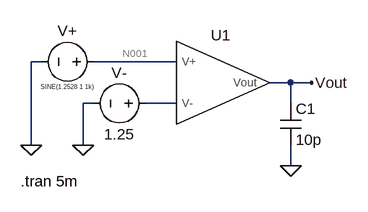
[diagram p0: schematic Draft1.asc]
Draft1.asc, the LTspice schematic file:
Version 4.1
SHEET 1 880 680
WIRE -80 144 -96 144
WIRE 128 144 0 144
WIRE 304 176 272 176
WIRE 336 176 304 176
WIRE 0 208 -16 208
WIRE 128 208 80 208
WIRE 304 208 304 176
WIRE -96 272 -96 144
WIRE -16 272 -16 208
WIRE 304 304 304 272
FLAG -16 272 0
FLAG -96 272 0
FLAG 304 304 0
FLAG 336 176 Vout
SYMBOL Wide_Output_OTA_SYM 192 176 R0
SYMATTR InstName U1
SYMBOL voltage 96 208 R90
WINDOW 0 -32 56 VBottom 2
WINDOW 3 32 56 VTop 2
SYMATTR InstName V-
SYMATTR Value 1.25
SYMBOL voltage 16 144 R90
WINDOW 0 -32 56 VBottom 2
WINDOW 3 32 56 VTop 0
WINDOW 123 0 0 Left 0
WINDOW 39 0 0 Left 0
SYMATTR InstName V+
SYMATTR Value SINE(1.2528 1 1k)
SYMBOL cap 288 208 R0
SYMATTR InstName C1
SYMATTR Value 10p
TEXT -112 328 Left 2 !.tran 5m

The netlist it stands for:
* Draft1.asc
X§U1 N001 N002 Vout Wide_Output_OTA_SYM  ; pins V+ V- Vout
V- N002 0 1.25
V+ N001 0 SINE(1.2528 1 1k)
C1 Vout 0 10p
.tran 5m
.backanno
.end

* Results of the author's LTspice run, read from the files saved beside the schematic
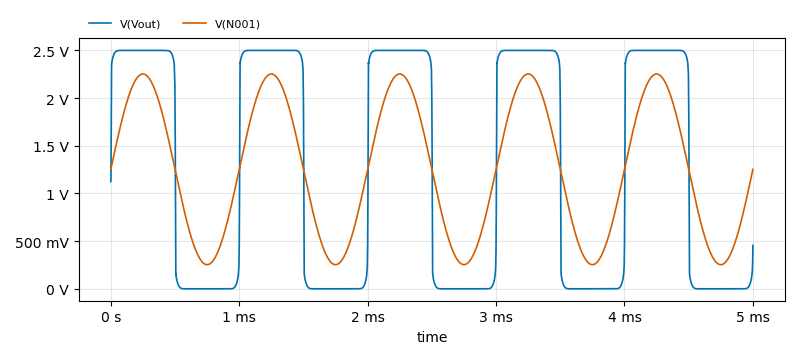
[diagram p1: Transient Analysis of Draft1.asc, plotted from the saved traces]
* Transient Analysis, 1 run:
*   V(Vout): min -24.43 µV, max 2.5 V, average 1.25 V, rms 1.756 V, last 455.1 mV
*   V(N001): min 252.8 mV, max 2.253 V, average 1.253 V, rms 1.439 V, last 1.253 V